# EAGLE schematic CD-Ripper (EAGLE 6.2)
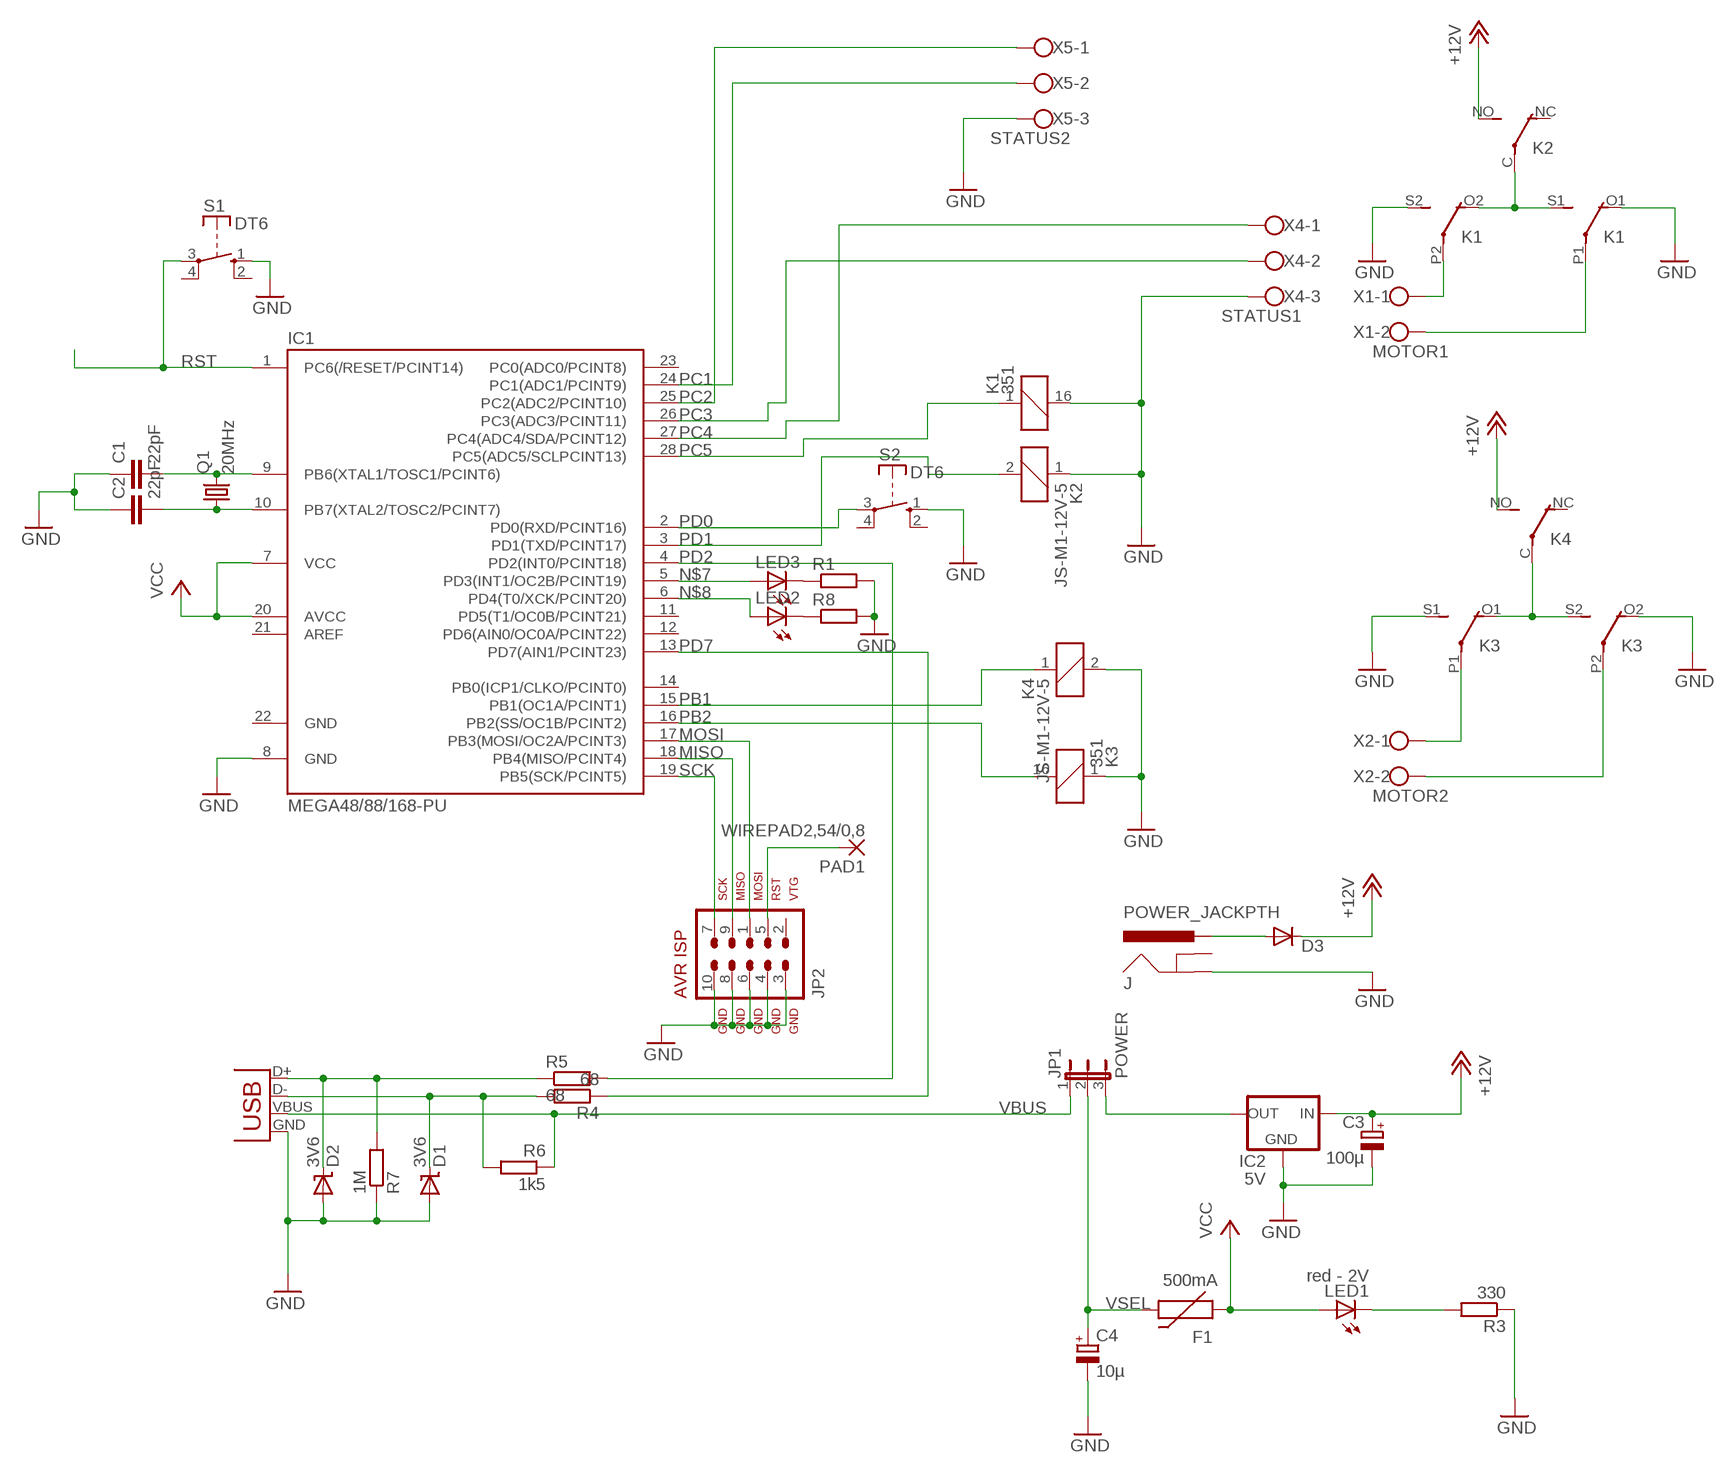
[diagram p0: schematic, sheet 1]

## Parts
C1  22pF  C2,5-3  [C2.5-3]
C2  22pF  C2,5-3  [C2.5-3]
C3  100µ  CPOL-EUE2,5-6E  [E2,5-6E]
C4  10µ  CPOL-EUE2.5-7  [E2,5-7]
D1  3V6  DIODE-ZENERPTH  [DIODE-ZENER]
D2  3V6  DIODE-ZENERPTH  [DIODE-ZENER]
D3  1N4148DO35-10  [DO35-10]
F1  500mA  PTCPTH  [PTC]
IC1  MEGA48/88/168-PU  [DIL28-3]
IC2  5V  V_REG_78XXSIDE  [78XXL]
J  POWER_JACKPTH  [POWER_JACK_PTH]
JP1  POWER  JP2E  [JP2]
JP2  AVR-ISP-10  [AVR-ISP-10]
K1  351  [351]
K2  JS-M1-12V-5  [JS-M]
K3  351  [351]
K4  JS-M1-12V-5  [JS-M]
LED1  red - 2V  LED5MM  [LED5MM]
LED2  LED5MM  [LED5MM]
LED3  LED5MM  [LED5MM]
PAD1  WIREPAD2,54/0,8  [2,54/0,8]
Q1  20MHz  CRYSTALHC49S  [HC49/S]
R1  R-EU_0204/7  [0204/7]
R3  330  R-EU_0204/7  [0204/7]
R4  68  R-EU_0204/7  [0204/7]
R5  68  R-EU_0204/7  [0204/7]
R6  1k5  R-EU_0204/7  [0204/7]
R7  1M  R-EU_0204/7  [0204/7]
R8  R-EU_0204/7  [0204/7]
S1  DT6  [DT6]
S2  DT6  [DT6]
X1  MOTOR1  W237-102  [W237-102]
X2  MOTOR2  W237-102  [W237-102]
X3  USBPTH  [USB-B-PTH]
X4  STATUS1  W237-103  [W237-103]
X5  STATUS2  W237-103  [W237-103]

## Nets
+12V: C3.+ D3.C IC2.IN K2.NO(2:S) K4.NO(2:S)
D+: D2.P$1(C) R5.1 R7.2 X3.D+
D-: D1.P$1(C) R4.2 R6.2 X3.D-
GND: C1.1 C2.1 C3.- C4.- D1.P$2(A) D2.P$2(A) IC1.8(GND) IC2.GND J.GND JP2.3 JP2.4 JP2.6 JP2.8 JP2.10 K1.16 K1.O1(2:O) K1.S2(3:S) K2.1 K3.1 K3.O2(3:O) K3.S1(2:S) K4.2 R1.2 R3.1 R7.1 R8.2 S1.1(S) S2.1(S) X3.GND X4.3 X5.3
MISO: IC1.18(PB4(MISO/PCINT4)) JP2.9
MOSI: IC1.17(PB3(MOSI/OC2A/PCINT3)) JP2.1
N$1: LED1.K(C) R3.2
N$2: D3.A J.PWR
N$3: K1.P2(3:P) X1.1
N$4: K1.P1(2:P) X1.2
N$5: K3.P1(2:P) X2.1
N$6: K3.P2(3:P) X2.2
N$7: IC1.5(PD3(INT1/OC2B/PCINT19)) LED3.A
N$8: IC1.6(PD4(T0/XCK/PCINT20)) LED2.A
N$9: LED3.K(C) R1.1
N$10: JP2.5 PAD1.1(P)
N$12: K1.O2(3:O) K1.S1(2:S) K2.C(2:P)
N$13: K3.O1(2:O) K3.S2(3:S) K4.C(2:P)
N$14: LED2.K(C) R8.1
PB1: IC1.15(PB1(OC1A/PCINT1)) K4.1
PB2: IC1.16(PB2(SS/OC1B/PCINT2)) K3.16
PC1: IC1.24(PC1(ADC1/PCINT9)) X5.2
PC2: IC1.25(PC2(ADC2/PCINT10)) X5.1
PC3: IC1.26(PC3(ADC3/PCINT11)) X4.2
PC4: IC1.27(PC4(ADC4/SDA/PCINT12)) X4.1
PC5: IC1.28(PC5(ADC5/SCLPCINT13)) K1.1
PD0: IC1.2(PD0(RXD/PCINT16)) S2.3(P)
PD1: IC1.3(PD1(TXD/PCINT17)) K2.2
PD2: IC1.4(PD2(INT0/PCINT18)) R5.2
PD7: IC1.13(PD7(AIN1/PCINT23)) R4.1
RST: IC1.1(PC6(/RESET/PCINT14)) S1.3(P)
SCK: IC1.19(PB5(SCK/PCINT5)) JP2.7
VBUS: JP1.1 R6.1 X3.VBUS
VCC: F1.P$1 IC1.7(VCC) IC1.20(AVCC) LED1.A
VREG: IC2.OUT JP1.3
VSEL: C4.+ F1.P$2 JP1.2
XTAL1: C1.2 IC1.9(PB6(XTAL1/TOSC1/PCINT6)) Q1.2
XTAL2: C2.2 IC1.10(PB7(XTAL2/TOSC2/PCINT7)) Q1.1
Unconnected: IC1.11(PD5(T1/OC0B/PCINT21)) IC1.12(PD6(AIN0/OC0A/PCINT22)) IC1.14(PB0(ICP1/CLKO/PCINT0)) IC1.21(AREF) IC1.23(PC0(ADC0/PCINT8)) J.GNDBREAK JP2.2 K2.NC(2:O) K4.NC(2:O) S1.2(S) S1.4(P) S2.2(S) S2.4(P)

## Power pins joined to a net without a drawn wire
GND: IC1.22(GND)

## Library data of the parts
C1 C2 = capacitor-wima:C: CAPACITOR naming: grid - package width
C3 C4 = resistor:CPOL-EU: POLARIZED CAPACITOR, European symbol
D1 D2 = SparkFun:DIODE-ZENER: Zener Diode Production Part - 8199 3.4V Zener Voltage
D3 = diode:1N4148: DIODE high speed (Philips)
F1 = SparkFun:PTC: Resettable Fuse PTC Resettable Fuse. Spark Fun Electronics SKU : COM-08357
IC1 = avr-7:MEGA48/88/168-PU
IC2 = SparkFun:V_REG_78XX: Voltage Regulator Standard 7805 5V regulator. IGO (Input Ground Output). Spark Fun Electronics SKU : COM-00107
J = SparkFun:POWER_JACK: Power Jack This is the standard 5.5mm barrel jack for power. The PTH is the most common, proven, reliable, footprint. All others are experimental. The Slot footprint only works if the mill layer is transmitted to the PCB fab house so be warned. Spark Fun Electronics SKU : PRT-00119. Mating wall wart : TOL-00298 (and others)
JP1 = jumper:JP2E: JUMPER
JP2 = avr-7:AVR-ISP-10: AVR ISP-10 Serial Programming Header
K1 K3 = relay:351: RELAY 2 x switch, Omron; OC_FARNELL: unknown; OC_NEWARK: unknown
K2 K4 = relay:JS-M1*: Automotive Ultra-Miniature Power Relay NAiS Source: http://www.mew-europe.com/.. en_ds_61211_0000.pdf; MF: FARNELL; MPN: JSM1-12V-5; OC_FARNELL: 910351; OC_NEWARK: 14J1764
LED1-LED3 = led:LED: LED OSRAM: - CHIPLED LG R971, LG N971, LY N971, LG Q971, LY Q971, LO R971, LY R971 LH N974, LH R974 LS Q976, LO Q976, LY Q976 LO Q996 - Hyper CHIPLED LW Q18S LB Q993, LB Q99A, LB R99A - SideLED LS A670, LO A670, LY A670, LG A670, LP A670 LB A673, LV A673, LT A673, LW A673 LH A674 LY A675 LS A676, LA A676, LO A676, LY A676, LW A676 LS A679, LY A679, LG A679 - Hyper Micro SIDELED® LS Y876, LA Y876, LO Y876, LY Y876 LT Y87S - SmartLED LW L88C, LW L88S LB L89C, LB L89S, LG L890 LS L89K, LO L89K, LY L89K LS L896, LA L896, LO L896, LY L896 - TOPLED LS T670, LO T670, LY T670, LG T670, LP T670 LSG T670, LSP T670, LSY T670, LOP T670, LYG T670 LG T671, LOG T671, LSG T671 LB T673, LV T673, LT T673, LW T673 LH T674 LS T676, LA T676, LO T676, LY T676, LB T676, LH T676, LSB T676, LW T676 LB T67C, LV T67C, LT T67C, LS T67K, LO T67K, LY T67K, LW E67C LS E67B, LA E67B, LO E67B, LY E67B, LB E67C, LV E67C, LT E67C LW T67C LS T679, LY T679, LG T679 LS T770, LO T770, LY T770, LG T770, LP T770 LB T773, LV T773, LT T773, LW T773 LH T774 LS E675, LA E675, LY E675, LS T675 LS T776, LA T776, LO T776, LY T776, LB T776 LHGB T686 LT T68C, LB T68C - Hyper Mini TOPLED® LB M676 - Mini TOPLED Santana® LG M470 LS M47K, LO M47K, LY M47K Source: http://www.osram.convergy.de LUXEON: - LUMILED® LXK2-PW12-R00, LXK2-PW12-S00, LXK2-PW14-U00, LXK2-PW14-V00 LXK2-PM12-R00, LXK2-PM12-S00, LXK2-PM14-U00 LXK2-PE12-Q00, LXK2-PE12-R00, LXK2-PE12-S00, LXK2-PE14-T00, LXK2-PE14-U00 LXK2-PB12-K00, LXK2-PB12-L00, LXK2-PB12-M00, LXK2-PB14-N00, LXK2-PB14-P00, LXK2-PB14-Q00 LXK2-PR12-L00, LXK2-PR12-M00, LXK2-PR14-Q00, LXK2-PR14-R00 LXK2-PD12-Q00, LXK2-PD12-R00, LXK2-PD12-S00 LXK2-PH12-R00, LXK2-PH12-S00 LXK2-PL12-P00, LXK2-PL12-Q00, LXK2-PL12-R00 Source: www.luxeon.com KINGBRIGHT: KA-3528ASYC Source: www.kingbright.com
PAD1 = wirepad:WIREPAD: Wire PAD connect wire on PCB
Q1 = crystal:CRYSTAL: CRYSTAL; OC_FARNELL: 1667008; OC_NEWARK: unknown
R1 R3-R8 = resistor:R-EU_: RESISTOR, European symbol
S1 S2 = switch-misc:DT: ITT SWITCH
X1 X2 = con-wago-500:W237-102: WAGO SCREW CLAMP; MPN: 237-102; OC_FARNELL: unknown; OC_NEWARK: 70K9898
X3 = SparkFun:USB: USB Connectors USB-B-PTH is fully proven SKU : PRT-00139 USB-miniB is fully proven SKU : PRT-00587 USB-A-PCB is untested. USB-A-H is throughly reviewed, but untested. Spark Fun Electronics SKU : PRT-00437 USB-B-SMT is throughly reviewed, but untested. Needs silkscreen touching up. USB-A-S has not been used/tested USB-MB-H has not been used/tested
X4 X5 = con-wago-500:W237-103: WAGO SCREW CLAMP; MPN: 237-103; OC_FARNELL: unknown; OC_NEWARK: 18M7116